# EAGLE schematic Electronics_Design_v1 (EAGLE 9.7.0)
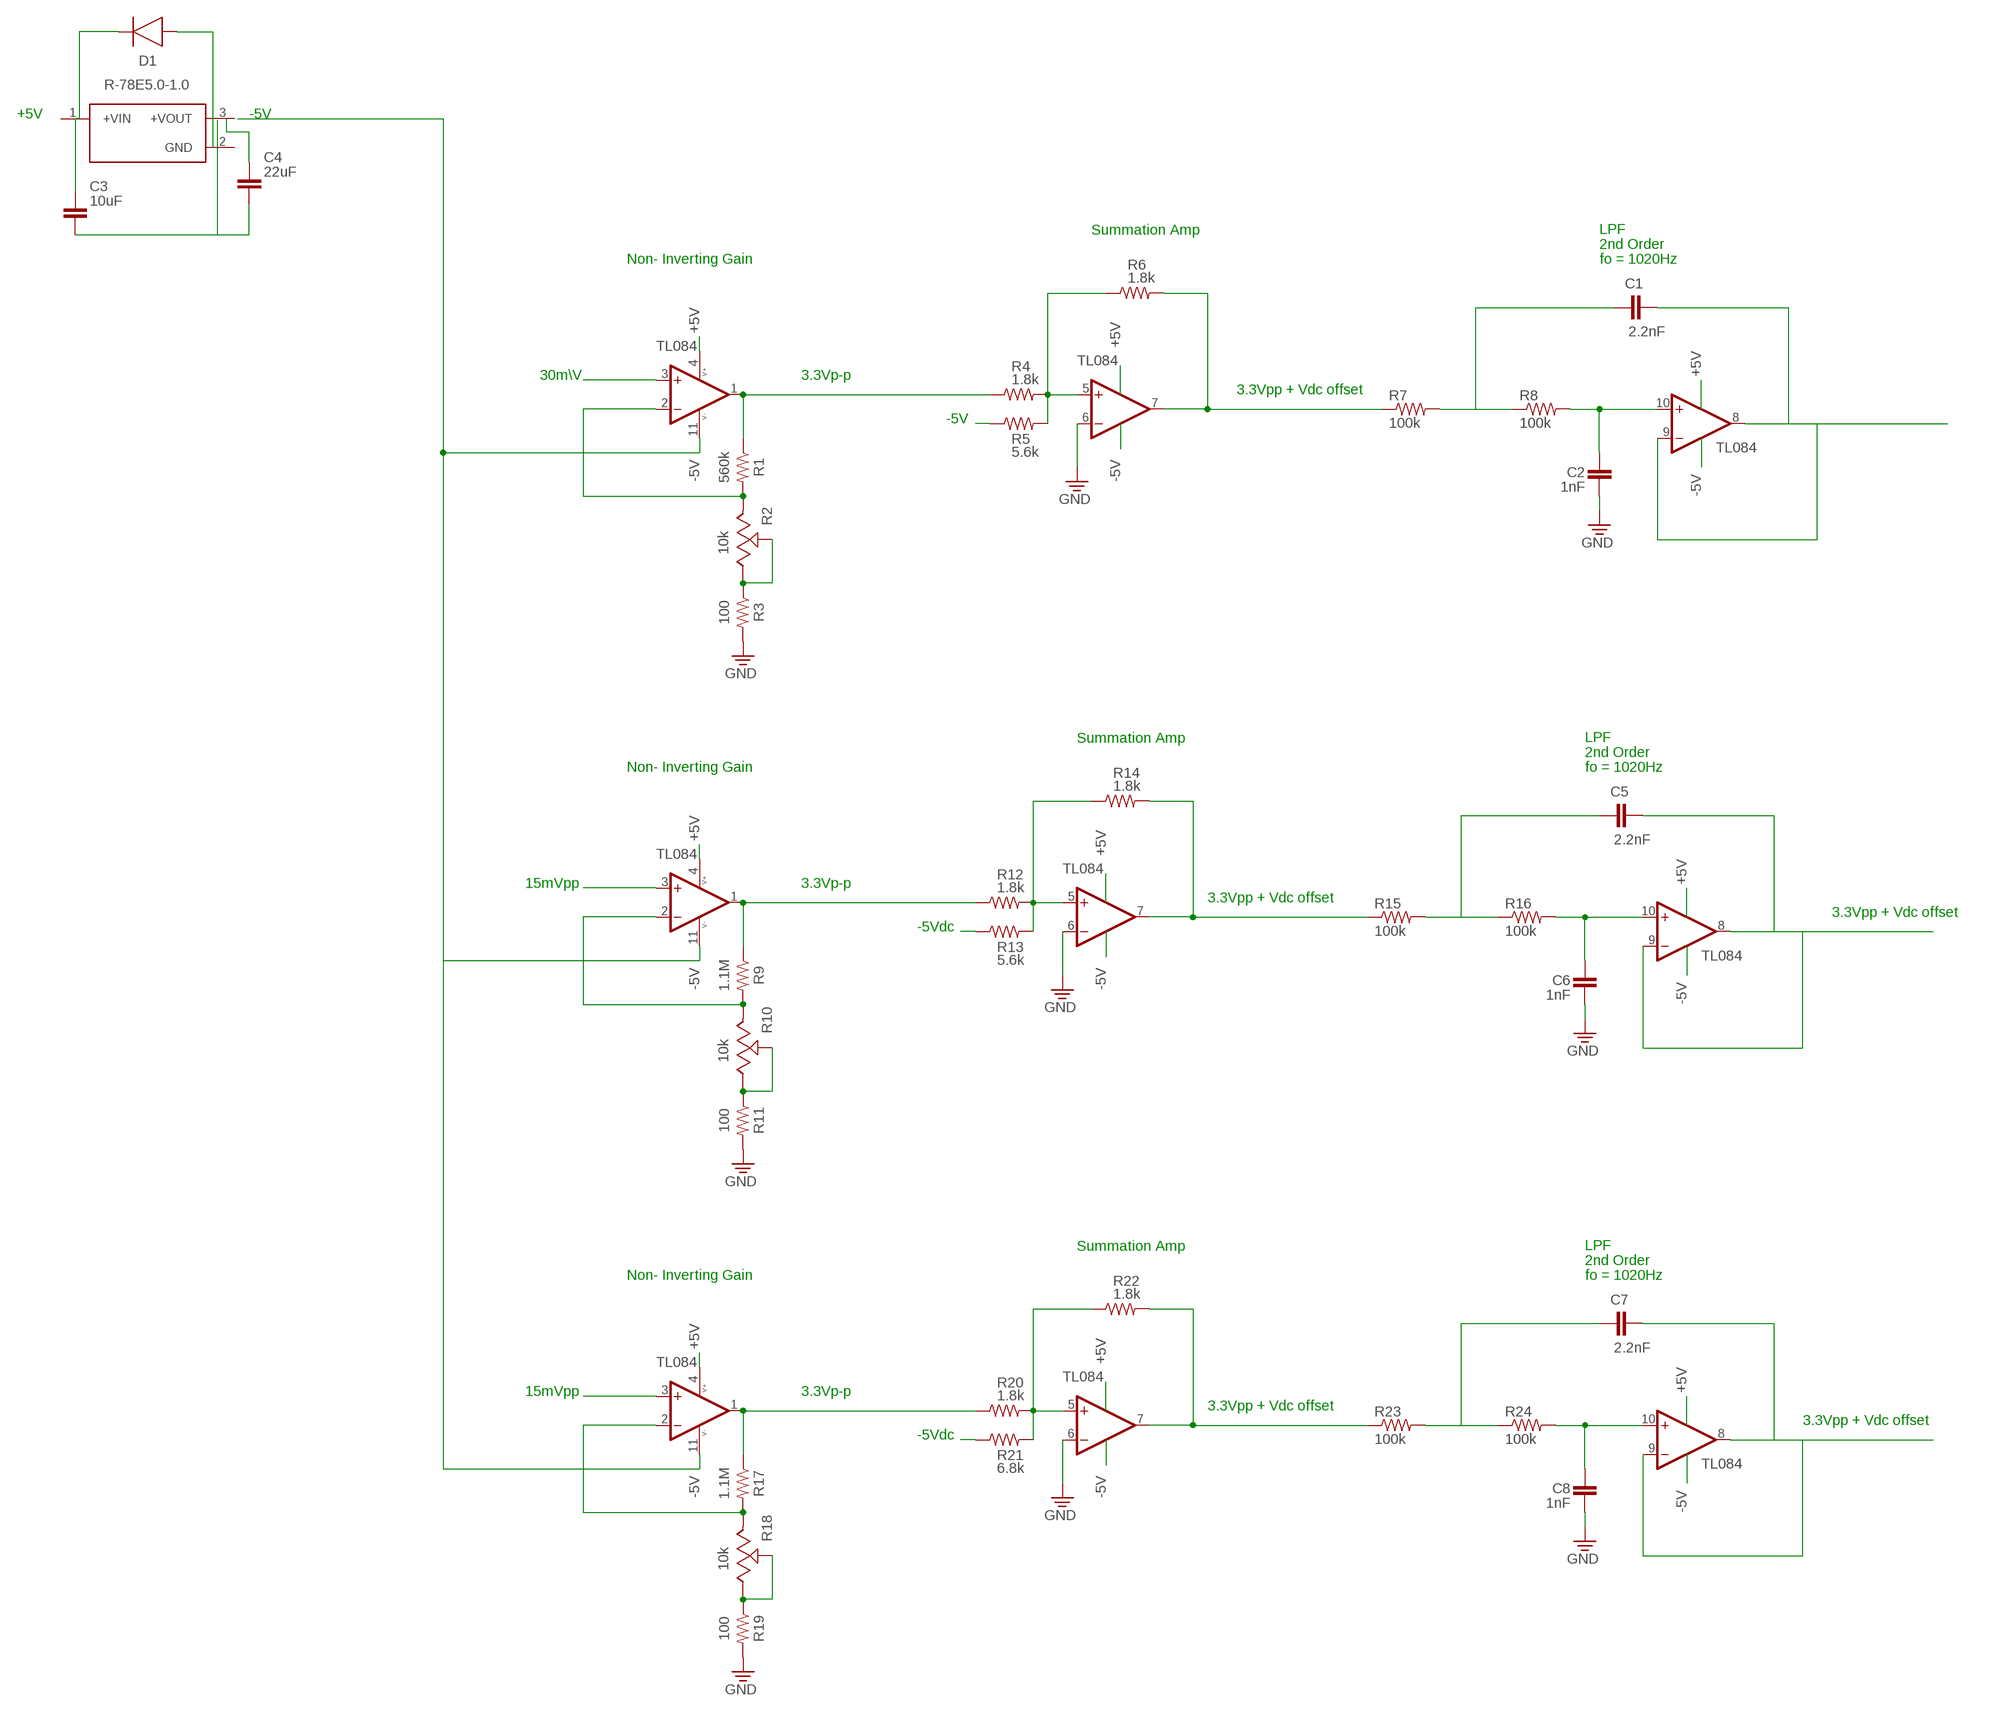
[diagram p0: schematic, sheet 1]

## Parts
C1  2.2nF  C_RADIAL-55.5MM-DIA  [CAPRD2261W240D5080H5555B]
C2  1nF  C_RADIAL-55.5MM-DIA  [CAPRD2261W240D5080H5555B]
C3  10uF  C_RADIAL-55.5MM-DIA  [CAPRD2261W240D5080H5555B]
C4  22uF  C_RADIAL-55.5MM-DIA  [CAPRD2261W240D5080H5555B]
C5  2.2nF  C_RADIAL-55.5MM-DIA  [CAPRD2261W240D5080H5555B]
C6  1nF  C_RADIAL-55.5MM-DIA  [CAPRD2261W240D5080H5555B]
C7  2.2nF  C_RADIAL-55.5MM-DIA  [CAPRD2261W240D5080H5555B]
C8  1nF  C_RADIAL-55.5MM-DIA  [CAPRD2261W240D5080H5555B]
D1  DIODE  DIODEDO-214AB(SMC)  [DIOM7959X625N]
PS1  R-78E5.0-1.0  [CONV_R-78E5.0-1.0]
R1  560k  R-US_AXIAL-7.2MM-PITCH  [RESAD724W46L381D178B]
R2  10k  3223W-1-201E  [3223W-1-201E]
R3  100  R-US_AXIAL-7.2MM-PITCH  [RESAD724W46L381D178B]
R4  1.8k  R-US_AXIAL-7.2MM-PITCH  [RESAD724W46L381D178B]
R5  5.6k  R-US_AXIAL-7.2MM-PITCH  [RESAD724W46L381D178B]
R6  1.8k  R-US_AXIAL-7.2MM-PITCH  [RESAD724W46L381D178B]
R7  100k  R-US_AXIAL-7.2MM-PITCH  [RESAD724W46L381D178B]
R8  100k  R-US_AXIAL-7.2MM-PITCH  [RESAD724W46L381D178B]
R9  1.1M  R-US_AXIAL-7.2MM-PITCH  [RESAD724W46L381D178B]
R10  10k  3223W-1-201E  [3223W-1-201E]
R11  100  R-US_AXIAL-7.2MM-PITCH  [RESAD724W46L381D178B]
R12  1.8k  R-US_AXIAL-7.2MM-PITCH  [RESAD724W46L381D178B]
R13  5.6k  R-US_AXIAL-7.2MM-PITCH  [RESAD724W46L381D178B]
R14  1.8k  R-US_AXIAL-7.2MM-PITCH  [RESAD724W46L381D178B]
R15  100k  R-US_AXIAL-7.2MM-PITCH  [RESAD724W46L381D178B]
R16  100k  R-US_AXIAL-7.2MM-PITCH  [RESAD724W46L381D178B]
R17  1.1M  R-US_AXIAL-7.2MM-PITCH  [RESAD724W46L381D178B]
R18  10k  3223W-1-201E  [3223W-1-201E]
R19  100  R-US_AXIAL-7.2MM-PITCH  [RESAD724W46L381D178B]
R20  1.8k  R-US_AXIAL-7.2MM-PITCH  [RESAD724W46L381D178B]
R21  6.8k  R-US_AXIAL-7.2MM-PITCH  [RESAD724W46L381D178B]
R22  1.8k  R-US_AXIAL-7.2MM-PITCH  [RESAD724W46L381D178B]
R23  100k  R-US_AXIAL-7.2MM-PITCH  [RESAD724W46L381D178B]
R24  100k  R-US_AXIAL-7.2MM-PITCH  [RESAD724W46L381D178B]
U1  TL084  [SOP65P640X120-14N]
U2  TL084  [SOP65P640X120-14N]
U3  TL084  [SOP65P640X120-14N]
U4  TL084  [SOP65P640X120-14N]
U5  TL084  [SOP65P640X120-14N]
U6  TL084  [SOP65P640X120-14N]
U7  TL084  [SOP65P640X120-14N]

## Nets
+5V: U1.4(VCC+) U2.4(VCC+) U5.4(VCC+)
+IN1: U1.3(+IN1)
+IN2: U2.3(+IN1)
+IN3: U5.3(+IN1)
-5V: U1.11(VCC-) U2.11(VCC-) U5.11(VCC-)
-IN1: R1.2 R2.1 U1.2(-IN1)
-IN2: R9.2 R10.1 U2.2(-IN1)
-IN3: R17.2 R18.1 U5.2(-IN1)
GND: C2.1 C6.1 C8.1 R3.2 R11.2 R19.2 U1.6(-IN2) U3.6(-IN2) U6.6(-IN2)
N$1: R4.2 R5.2 R6.1 U1.5(+IN2)
N$2: R2.2 R2.3 R3.1
N$3: R1.1 R4.1 U1.1(OUT1)
N$4: R5.1
N$5: R6.2 R7.1 U1.7(OUT2)
N$8: C1.1 R7.2 R8.1
N$9: C2.2 R8.2 U1.10(+IN3)
N$10: C1.2
N$11: U1.9(-IN3)
N$12: U1.8(OUT3)
N$15: C3.1 D1.1(C)
N$16: C4.2
N$17: D1.2(A)
N$18: C3.2
N$19: C4.1
N$20: R10.2 R10.3 R11.1
N$21: R18.2 R18.3 R19.1
N$22: R9.1 R12.1 U2.1(OUT1)
N$23: R12.2 R13.2 R14.1 U3.5(+IN2)
N$24: R13.1
N$25: R14.2 R15.1 U3.7(OUT2)
N$28: C5.1 R15.2 R16.1
N$29: C6.2 R16.2 U4.10(+IN3)
N$30: C5.2
N$31: U4.9(-IN3)
N$32: U4.8(OUT3)
N$35: R17.1 R20.1 U5.1(OUT1)
N$36: R20.2 R21.2 R22.1 U6.5(+IN2)
N$37: R21.1
N$38: R22.2 R23.1 U6.7(OUT2)
N$41: C7.1 R23.2 R24.1
N$42: C8.2 R24.2 U7.10(+IN3)
N$43: C7.2
N$44: U7.9(-IN3)
N$45: U7.8(OUT3)
Unconnected: PS1.1(+VIN) PS1.3(+VOUT) U1.12(+IN4) U1.13(-IN4) U1.14(OUT4) U2.5(+IN2) U2.6(-IN2) U2.7(OUT2) U2.8(OUT3) U2.9(-IN3) U2.10(+IN3) U2.12(+IN4) U2.13(-IN4) U2.14(OUT4) U3.1(OUT1) U3.2(-IN1) U3.3(+IN1) U3.8(OUT3) U3.9(-IN3) U3.10(+IN3) U3.12(+IN4) U3.13(-IN4) U3.14(OUT4) U4.1(OUT1) U4.2(-IN1) U4.3(+IN1) U4.5(+IN2) U4.6(-IN2) U4.7(OUT2) U4.12(+IN4) U4.13(-IN4) U4.14(OUT4) U5.5(+IN2) U5.6(-IN2) U5.7(OUT2) U5.8(OUT3) U5.9(-IN3) U5.10(+IN3) U5.12(+IN4) U5.13(-IN4) U5.14(OUT4) U6.1(OUT1) U6.2(-IN1) U6.3(+IN1) U6.8(OUT3) U6.9(-IN3) U6.10(+IN3) U6.12(+IN4) U6.13(-IN4) U6.14(OUT4) U7.1(OUT1) U7.2(-IN1) U7.3(+IN1) U7.5(+IN2) U7.6(-IN2) U7.7(OUT2) U7.12(+IN4) U7.13(-IN4) U7.14(OUT4)

## Buses
B$1

## Notes on the sheet
- +5V | -5V
- Summation Amp
- LPF
  2nd Order
- Non- Inverting Gain | fo = 1020Hz
- 30m\V | 3.3Vp-p
- 3.3Vpp + Vdc offset
- -5V
- Summation Amp
- LPF
  2nd Order
- Non- Inverting Gain | fo = 1020Hz
- 15mVpp | 3.3Vp-p
- 3.3Vpp + Vdc offset
- 3.3Vpp + Vdc offset
- -5Vdc
- Summation Amp
- LPF
  2nd Order
- Non- Inverting Gain | fo = 1020Hz
- 15mVpp | 3.3Vp-p
- 3.3Vpp + Vdc offset
- 3.3Vpp + Vdc offset
- -5Vdc

## Power pins joined to a net without a drawn wire
GND: PS1.2(GND)
VCC+: U3.4(VCC+) U4.4(VCC+) U6.4(VCC+) U7.4(VCC+)
VCC-: U3.11(VCC-) U4.11(VCC-) U6.11(VCC-) U7.11(VCC-)

## Library data of the parts
C1-C8 = Capacitor:C: Capacitor - Generic; CATEGORY: Capacitor
D1 = Diode:DIODE: Diode Rectifier - Generic; CATEGORY: Diode; SUB-CATEGORY: Rectifier
PS1 = R-78E5.0-1.0:R-78E5.0-1.0: 1.0 Amp SIP3 Single Output; MANUFACTURER: RECOM; MAXIMUM_PACKAGE_HEIGHT: 10.40mm; PARTREV: 6; STANDARD: Manufacturer Recommendations
R1 R3 R9 R11 R17 R19 = Resistor:R-US: Resistor Fixed - ANSI; CATEGORY: Resistor; SUB-CATEGORY: Fixed
R2 R10 R18 = Potentiometer_Trimmers:3223W-1-201E: TRIMMER 200OHM 0.125W J LEAD TOP Manufacturer's datasheet <https://www.bourns.com/docs/Product-Datasheets/3223.pdf>; CREATED_BY: PCBLayout.com; DIGIKEY_PN: 3223W-1-201ETR-ND; MANUFACTURER: Bourns Inc.; MPN: 3223W-1-201E
R4-R8 R12-R16 R20-R24 = Tutorial - Fusion 360:R-US: Resistor Fixed - ANSI; CATEGORY: Resistor; SUB-CATEGORY: Fixed
U1-U7 = TL084:TL084: GENERAL PURPOSE J-FET QUAD OPERATIONAL AMPLIFIERS; A1_MIN: 0.15; A_MAX: 1.2; A_MIN: 1.2; A_NOM: 1.2; B_MAX: 0.3; B_MIN: 0.19; B_NOM: 0.245; D2_MAX: 0.0; D_MAX: 5.1; D_MIN: 4.9; D_NOM: 5.0; E1_MAX: 4.5; E1_MIN: 4.3; E1_NOM: 4.4; E2_MAX: 0.0; ENOM: 0.65; E_MAX: 6.4; E_MIN: 6.4; E_NOM: 6.4; L_MAX: 0.75; L_MIN: 0.5; L_NOM: 0.625; MANUFACTURER: Texas Instruments; MAXIMUM_PACKAGE_HEIGHT: 1.2mm; PIN_COUNT: 14.0; STANDARD: IPC 7351B